# Altium schematic sheet DC-DC Converter.SchDoc
size A; SheetNumber: 1; SheetTotal: 7
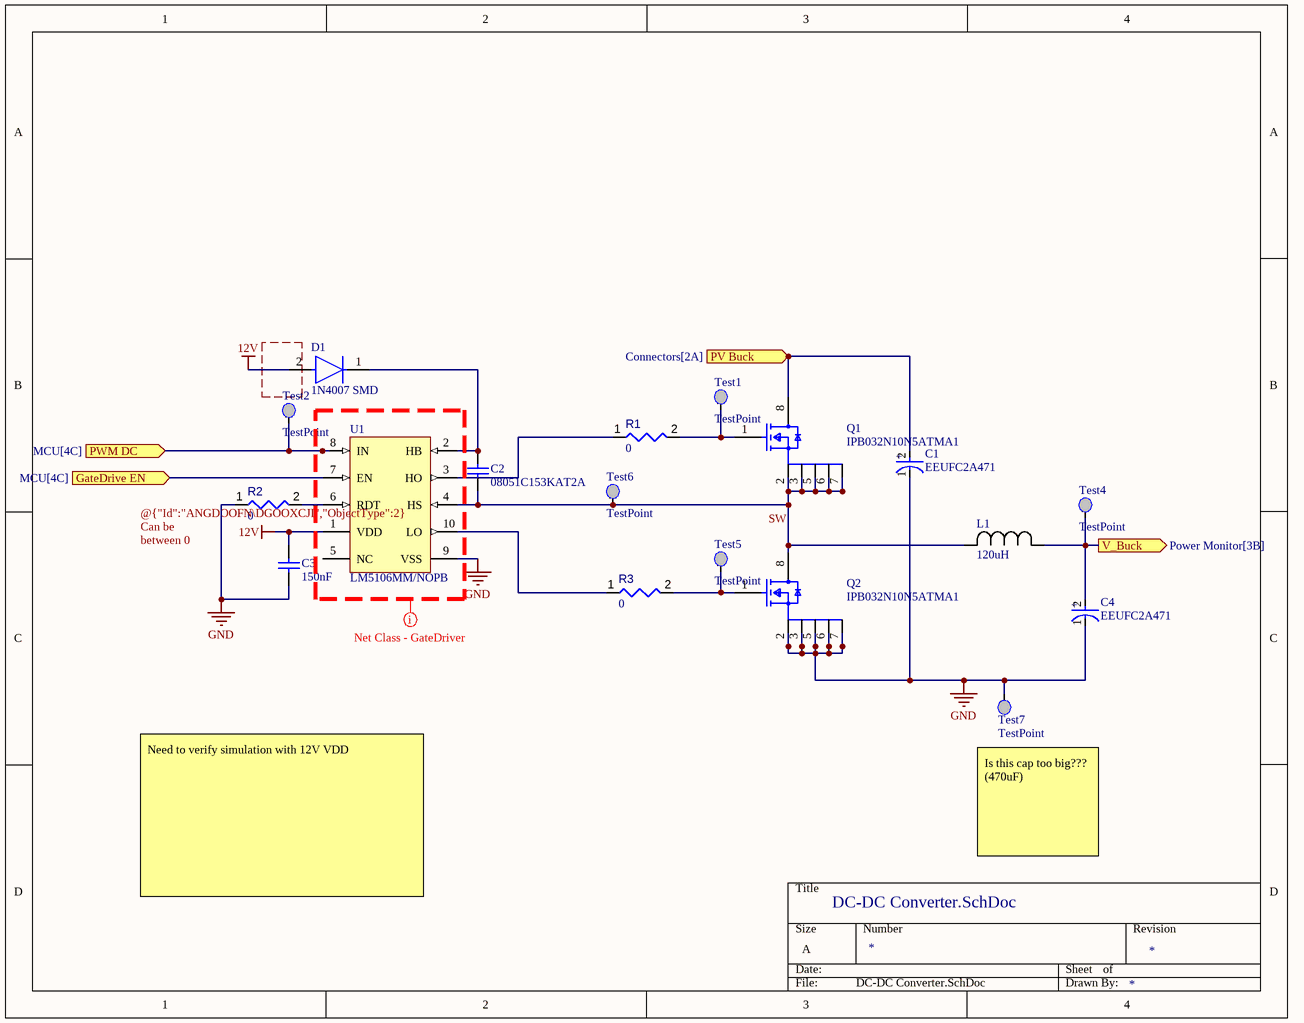
[diagram p0: DC-DC Converter.SchDoc]

## Parts
C1  EEUFC2A471  [FP-RAD-TH-D_16_0_5-L_40_2-MFG]
C2  08051C153KAT2A  [CAPC2013X94X50NL20T25]
C3  150nF  [CAPC2013X140X50LL20T25]
C4  EEUFC2A471  [FP-RAD-TH-D_16_0_5-L_40_2-MFG]
D1  1N4007 SMD  [FP-1N4007_SMD-IPC_C]
L1  120uH  [IND_2300HT-V_56_42]
Q1  IPB032N10N5ATMA1  [FP-PG-TO263-7-MFG]
Q2  IPB032N10N5ATMA1  [FP-PG-TO263-7-MFG]
R1  value 0  [RESC0603(1608)_L]  (hidden comment: 0R3J)
R2  value 0  [RESC0603(1608)_L]  (hidden comment: 0R3J)
R3  value 0  [RESC0603(1608)_L]  (hidden comment: 0R3J)
Test1  TestPoint  [Test_IN]  (no BOM)
Test2  TestPoint  [Test_IN]  (no BOM)
Test4  TestPoint  [Test_IN]  (no BOM)
Test5  TestPoint  [Test_IN]  (no BOM)
Test6  TestPoint  [Test_IN]  (no BOM)
Test7  TestPoint  [Test_IN]  (no BOM)
U1  LM5106MM/NOPB  [DGS0010A_N]

## Ports
GateDrive EN (in, see MCU[4C]), PV Buck (in, see Connectors[2A]), PWM DC (in, see MCU[4C]), V_Buck (out, see Power Monitor[3B])

## Nets
12V: C3.2 D1.2(A) U1.1(VDD)
GND: C1.1(C) C3.1 C4.1(C) Q2.2(SOURCE) Q2.3(SOURCE) Q2.5(SOURCE) Q2.6(SOURCE) Q2.7(SOURCE) R2.1 Test7.IN U1.9(VSS)
GateDrive EN: U1.7(EN) ; port GateDrive EN
PV Buck: C1.2(A) Q1.8(DRAIN) ; port PV Buck
PWM DC: Test2.IN U1.8(IN) ; port PWM DC
SW: C2.1 L1.2 Q1.2(SOURCE) Q1.3(SOURCE) Q1.5(SOURCE) Q1.6(SOURCE) Q1.7(SOURCE) Q2.8(DRAIN) Test6.IN U1.4(HS)
V_Buck: C4.2(A) L1.1 Test4.IN ; port V_Buck
NetC2_2: C2.2 D1.1(C) U1.2(HB)
NetQ1_1: Q1.1(GATE) R1.2 Test1.IN
NetQ2_1: Q2.1(GATE) R3.2 Test5.IN
NetR1_1: R1.1 U1.3(HO)
NetR2_2: R2.2 U1.6(RDT)
NetR3_1: R3.1 U1.10(LO)

Not connected (* = marked no-connect by the designer): U1 5(NC)

## Layout directives
net class GateDriver: (no net found under the mark)

## Notes on the sheet
- (near R2) @{"Id":"ANGDOOFN\DGOOXCJI","ObjectType":2} Can be between 0 and 150k
- Need to verify simulation with 12V VDD
- (near Test7) Is this cap too big???
  (470uF)
- (in symbol CMP-05427-000270-1) +

## Library data of the parts
C1 C4 = CMP-05427-000270-1: Aluminum Electrolytic Capacitors (Radial Lead Type) AEC-Q200 Qualified 470uF ±20% 100V; Ripple Current: 1.92A; Impedance: 47mR; Polarity: Polar; Dielectric Material: Aluminium; Lead Diameter: 0.8mm; Life (Hours): 5000Hour; Leakage Current: 3uA; Radiation Hardening: No; REACH SVHC: No SVHC; Height: 40mm; Ratings: AEC-Q200; Max Operating Temperature: 105°C; RoHS Compliant: Yes; Construction: RADIAL; Lead Pitch: 7.5mm; Contact Plating: Tin; Voltage: 100V; Length: 40mm; Packaging: Bulk; Diameter: 16mm; Height - Seated (Max): 1.575inch; Voltage Rating (DC): 100V; Voltage Rating: 100V; ESR (Equivalent Series Resistance): 47mR; Case/Package: Radial; Lead Free: Lead Free; Tolerance: 20%; Series: FC; Capacitance: 470uF; Package Quantity: 100; Mount: Through Hole; Min Operating Temperature: -55°C; Termination: Radial
C2 = CMP-2007-04180-1: 15nF / 0.01uF; Manufacturer: AVX Interconnect / Elco; Part Number: 08051C153KAT2A
C3 = CMP-1036-04480-3: 08053C154KAT2A; Manufacturer: AVX Interconnect / Elco; Part Number: 08053C154KAT2A
D1 = CMP-12389-000001-1: Rectifier, 1Kv, 1A, Do-214Ac Rohs Compliant: Yes
L1 = 2300HT-121-V-RC: 120uH / 2300HT-121-V-RC; Mfr_Name: Bourns Electronics
Q1 Q2 = CMP-32901-001276-1: MOSFET N-CH 100V 166A TO263-7; Input Capacitance: 6.97nF; Max Power Dissipation: 187W; Rds On Max: 3.2mR; Min Operating Temperature: -55°C; Mount: Surface Mount; RoHS Compliant: Yes; Continuous Drain Current (ID): 166A; Packaging: Tape and Reel; Case/Package: TO-263-7; Halogen Free: Halogen Free; Max Dual Supply Voltage: 100V; Lead Free: Contains Lead; Drain to Source Voltage (Vdss): 100V; Max Operating Temperature: 175°C; Series: OptiMOS™
R1-R3 = CMP-009-00063-2: Jumper 0603 (1608 Metric); Case/Package: 0603; Mounting Technology: SMT; Pins: 2
U1 = CMP-0063-01354-3: 100V Half-Bridge Gate Driver with Programmable Dead-Time, 10-pin MSOP, Pb-Free; Manufacturer: Texas Instruments; PackageTopMarking: ZXTT*5106; PowerWise: N; CompType: MiscPower; PinCount: 10; Code_JEDEC: MO-187-BA; PackageReference: DGS0010A; PackageDescription: Mini-SO, Molded, .118 x .118 x .034in Body, 10 Lead, .0197in Pitch; ComponentLink1URL: http://www.ti.com/general/docs/lit/getliterature.tsp?genericPartNumber=LM5106&fileType=pdf; ComponentLink1Description: Datasheet URL; RoHS: Y